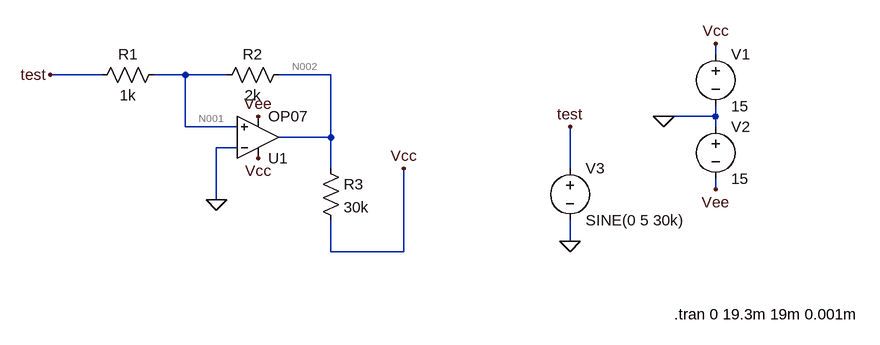
[diagram p0: schematic filter.asc]
filter.asc, the LTspice schematic file:
Version 4
SHEET 1 1416 1108
WIRE -1248 -208 -1248 -224
WIRE -2192 -176 -2272 -176
WIRE -2064 -176 -2112 -176
WIRE -2000 -176 -2064 -176
WIRE -1840 -176 -1920 -176
WIRE -1328 -112 -1344 -112
WIRE -1248 -112 -1248 -128
WIRE -1248 -112 -1328 -112
WIRE -2064 -96 -2064 -176
WIRE -1984 -96 -2064 -96
WIRE -1248 -96 -1248 -112
WIRE -1840 -80 -1840 -176
WIRE -1840 -80 -1920 -80
WIRE -1984 -64 -2016 -64
WIRE -1840 -32 -1840 -80
WIRE -1472 -32 -1472 -96
WIRE -1248 0 -1248 -16
WIRE -2016 16 -2016 -64
WIRE -1472 80 -1472 48
WIRE -1840 96 -1840 48
WIRE -1728 96 -1728 -32
WIRE -1728 96 -1840 96
FLAG -1248 -224 Vcc
FLAG -1248 0 Vee
FLAG -1328 -112 0
FLAG -1472 80 0
FLAG -1472 -96 test
FLAG -1952 -112 Vee
FLAG -1952 -48 Vcc
FLAG -2272 -176 test
FLAG -2016 16 0
FLAG -1728 -32 Vcc
SYMBOL voltage -1248 -224 R0
WINDOW 123 0 0 Left 0
WINDOW 39 0 0 Left 0
SYMATTR InstName V1
SYMATTR Value 15
SYMBOL voltage -1248 -112 R0
WINDOW 123 0 0 Left 0
WINDOW 39 0 0 Left 0
SYMATTR InstName V2
SYMATTR Value 15
SYMBOL voltage -1472 -48 R0
WINDOW 123 0 0 Left 0
WINDOW 39 0 0 Left 0
SYMATTR InstName V3
SYMATTR Value SINE(0 5 30k)
SYMBOL Opamps\\OP07 -1952 -16 M180
SYMATTR InstName U1
SYMBOL res -2096 -192 R90
WINDOW 0 0 56 VBottom 2
WINDOW 3 32 56 VTop 2
SYMATTR InstName R1
SYMATTR Value 1k
SYMBOL res -1904 -192 R90
WINDOW 0 0 56 VBottom 2
WINDOW 3 32 56 VTop 2
SYMATTR InstName R2
SYMATTR Value 2k
SYMBOL res -1856 -48 R0
SYMATTR InstName R3
SYMATTR Value 30k
TEXT -1312 192 Left 2 !.tran 0 19.3m 19m 0.001m

The netlist it stands for:
* filter.asc
V1 Vcc 0 15
V2 0 Vee 15
V3 test 0 SINE(0 5 30k)
XU1 N001 0 Vcc Vee N002 LT1001  ; OP07, pins In+ In- V+ V- OUT
R1 N001 test 1k
R2 N002 N001 2k
R3 N002 Vcc 30k
.tran 0 19.3m 19m 0.001m
.lib LTC.lib
.backanno
.end

* Results of the author's LTspice run, read from the files saved beside the schematic
* Operating Point, zero values left out:
*   V(vcc) = 15 V
*   V(vee) = -15 V
*   V(n001) = 3.48 V
*   V(n002) = 13.88 V
*   I(R3) = -37.17 µA
*   I(R2) = 5.202 mA
*   I(R1) = 3.48 mA
*   I(V3) = 3.48 mA
*   I(V2) = -410 µA
*   I(V1) = -5.605 mA
*   Ix(u1:1) = 1.722 mA
*   Ix(u1:2) = -1.722 mA
*   Ix(u1:3) = 5.568 mA
*   Ix(u1:4) = -410 µA
*   Ix(u1:5) = -5.165 mA
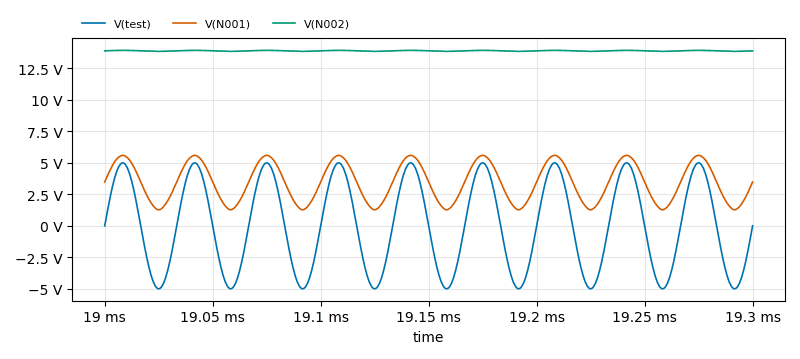
[diagram p1: Transient Analysis of filter.asc, plotted from the saved traces]
* Transient Analysis, 1 run:
*   V(test): min -4.998 V, max 4.998 V, average -8.353 µV, rms 3.537 V, last 0 V
*   V(N001): min 1.271 V, max 5.592 V, average 3.467 V, rms 3.78 V, last 3.48 V
*   V(N002): min 13.85 V, max 13.92 V, average 13.88 V, rms 13.88 V, last 13.88 V